# EAGLE design LB_BIT_w29_PERF-v03(1_3) (EAGLE 6.6.0)
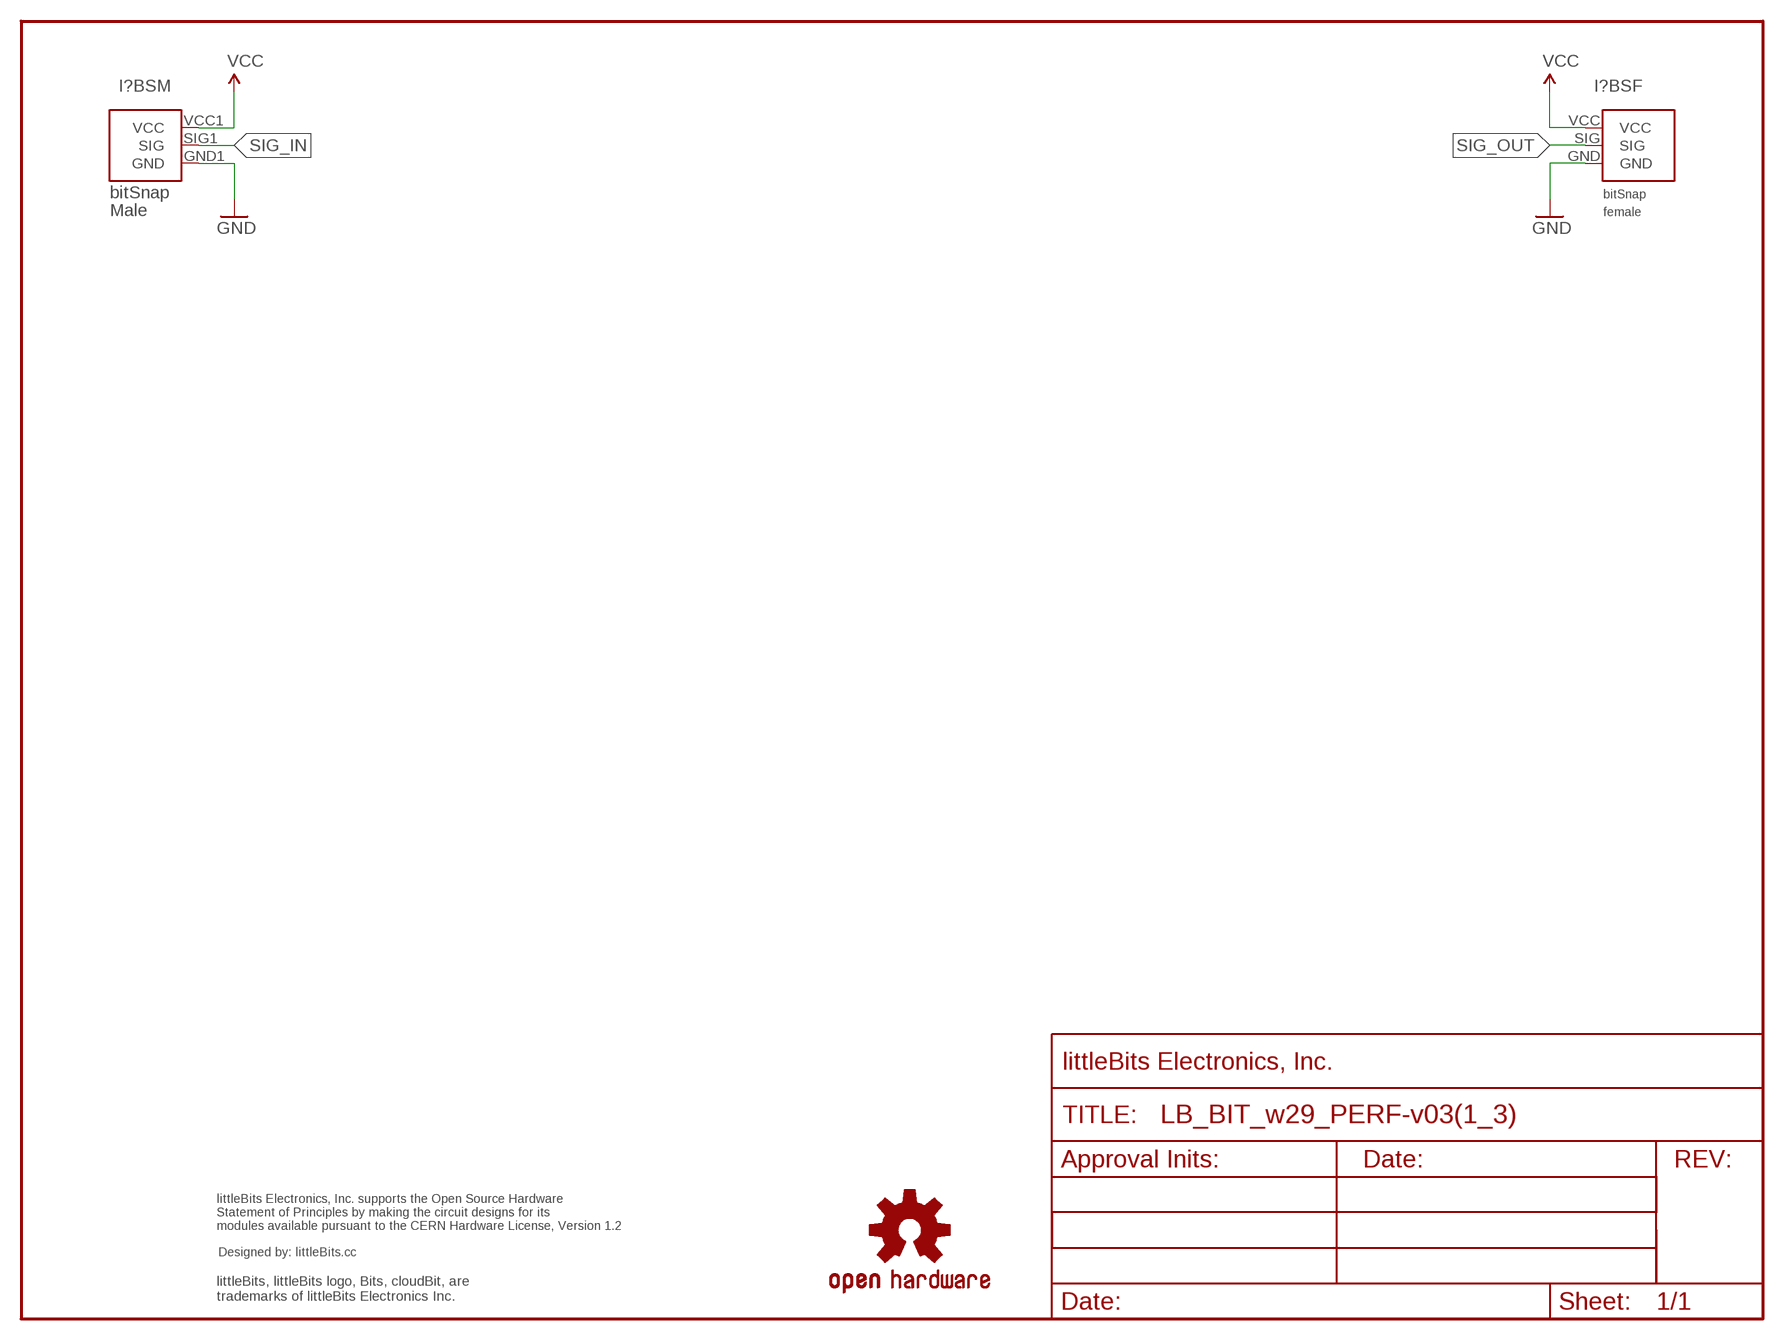
[diagram p0: schematic, sheet 1]

## Parts
I?BSF  BITSNAP_V03_FEMALE  [BITSNAP_V03_FEMALE]
I?BSM  BITSNAP_V03_MALE  [BITSNAP_V03_MALE]
U$1  OSHWCREDIT  [OSHWCREDIT]
U$2  OSHW-LOGOL  [OSHW-LOGO-L]
U$18  FRAME-LETTER-OHWOHW  [FABDWG01-OHW]

## Nets
GND: I?BSF.GND I?BSM.GND1(GND)
SIG_IN: I?BSM.SIG1(SIG)
SIG_OUT: I?BSF.SIG
VCC: I?BSF.VCC I?BSM.VCC1(VCC)

## Library data of the parts
I?BSF = bitSnap:BITSNAP_V03_FEMALE
I?BSM = bitSnap:BITSNAP_V03_MALE
U$1 = LITTLEBITS:OSHWCREDIT
U$2 = LITTLEBITS131206:OSHW-LOGO: Open Source Hardware Logo This logo indicates the piece of hardware it is found on incorporates a OSHW license and/or adheres to the definition of open source hardware found here: http://freedomdefined.org/OSHW
U$18 = LITTLEBITS:FRAME-LETTER-OHW

## Board
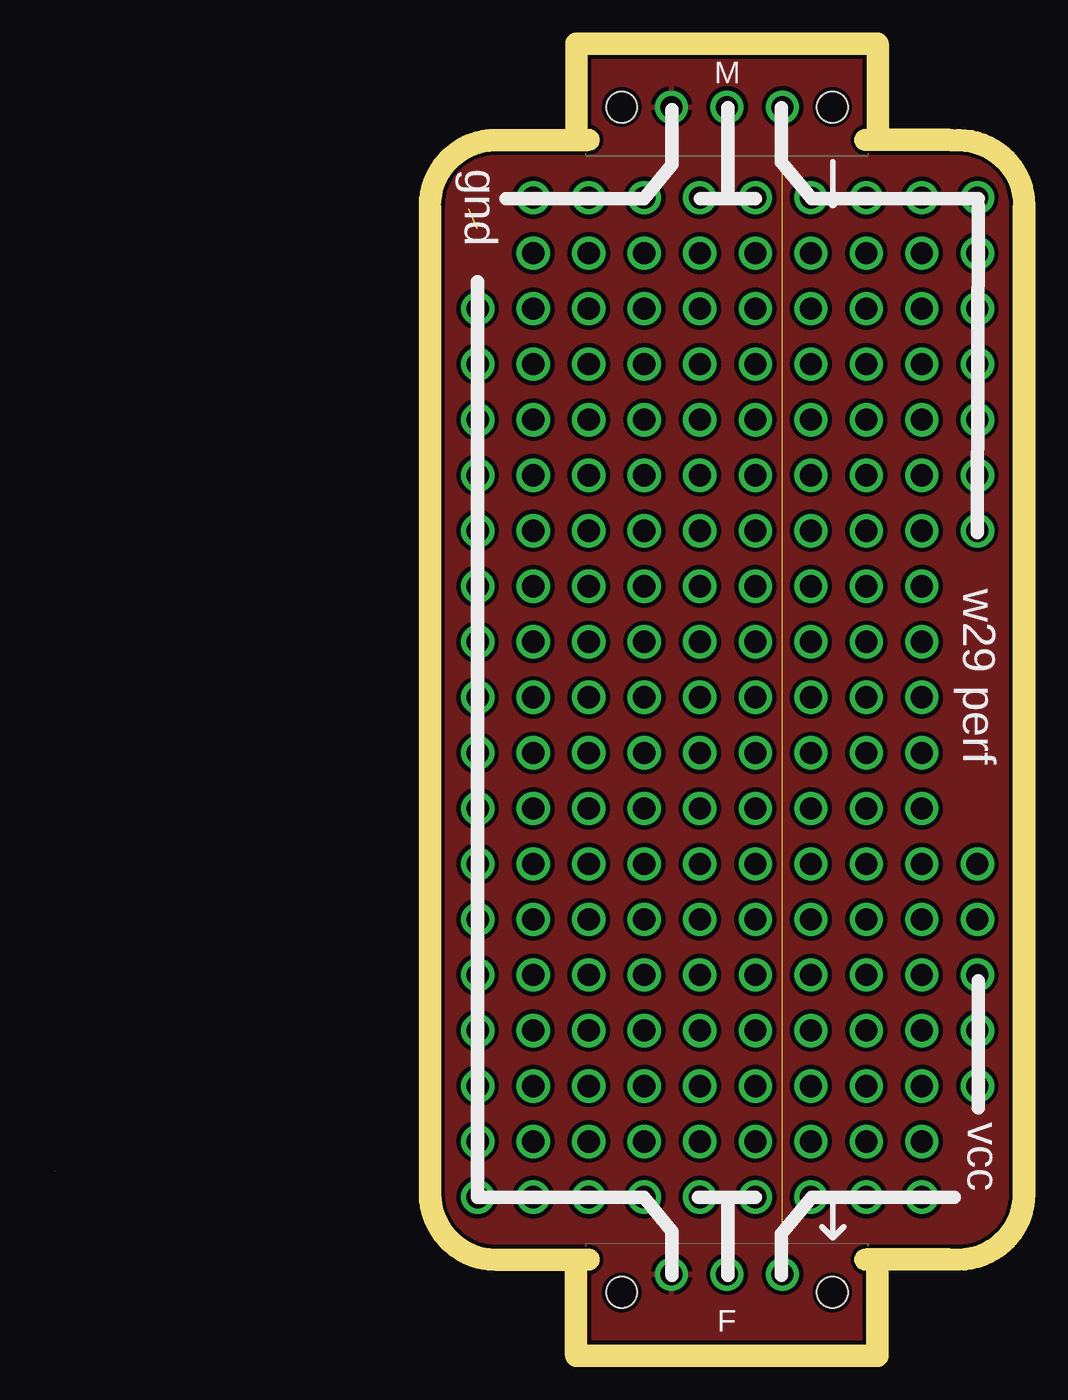
[diagram p1: board, top side]
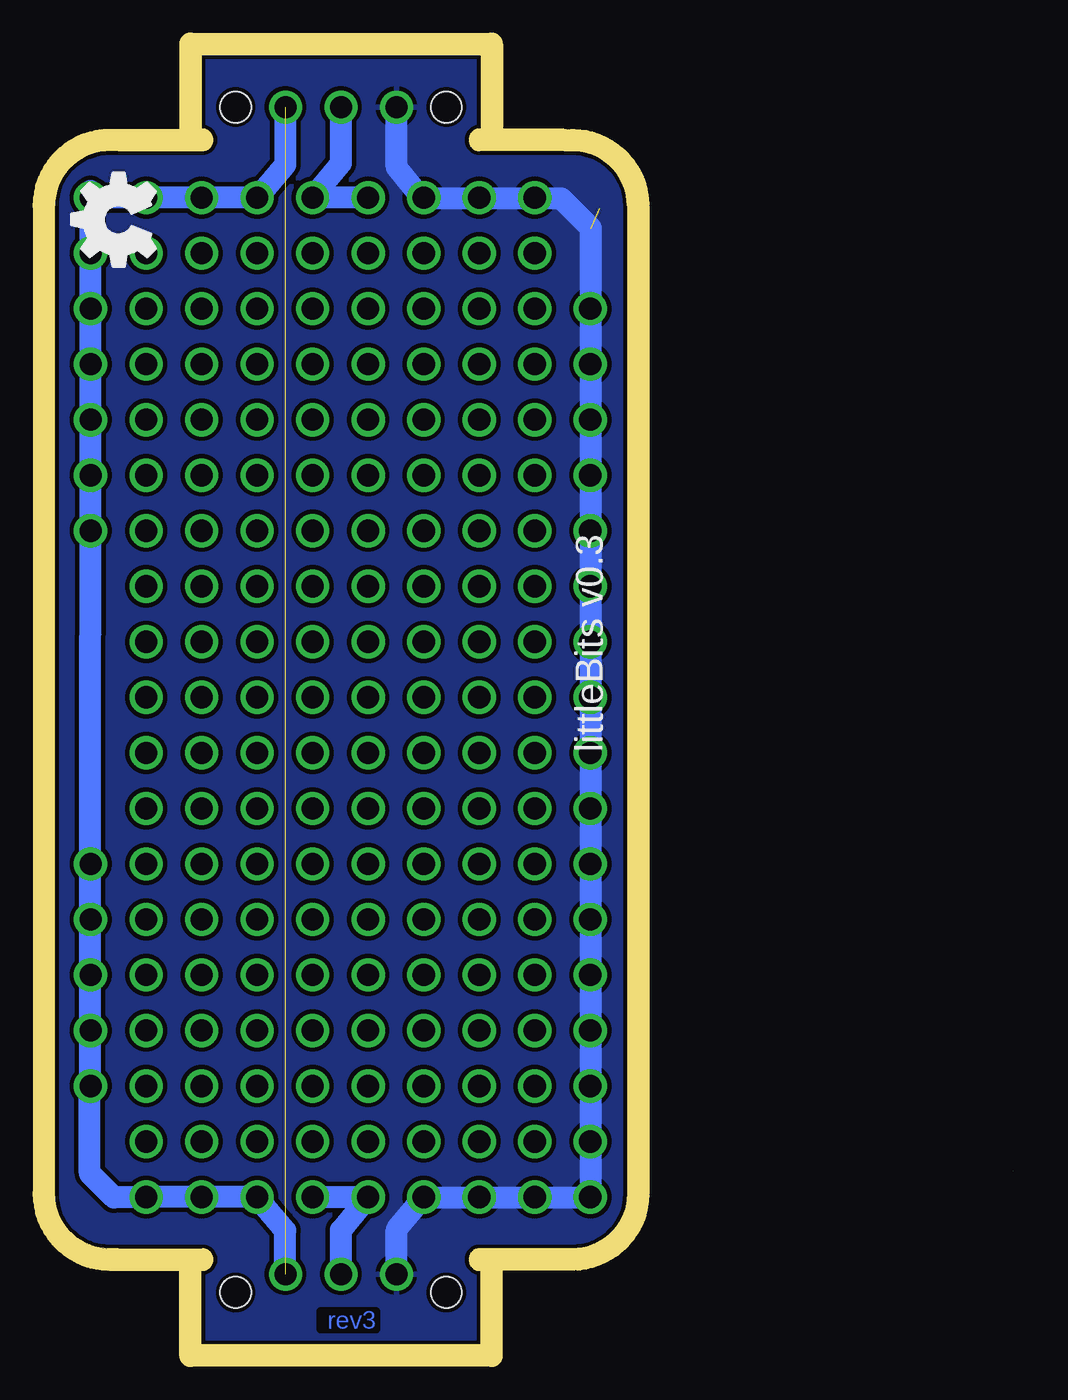
[diagram p2: board, bottom side, seen from below]

Size 43.86 x 59.02 mm. Coordinates in mm from the lower left corner, seen from the top.
Outline: 20.56,4.4 20.16,4.4 arc-90 17.66,6.9 17.66,52.12 arc-90 20.16,54.62 20.56,54.62
Outline: 40.96,54.62 41.36,54.62 arc-90 43.86,52.12 43.86,6.9 arc-90 41.36,4.4 40.96,4.4
Outline: 0,7.95 arc0 0,7.95
Copper layers (1*16): Top 0.035mm / dielectric 1.5mm / Bottom 0.035mm
Design rules "default": minimum track width 0.2mm, minimum drill 0.4mm, track to track 0.2mm, track to pad 0.2mm, pad to pad 0.2mm, via to via 0.2mm, smd to smd 0mil, copper to edge 0.2mm, drill to drill 0.2mm, minimum pad ring 0.2mm, minimum via ring 0.15mm, stop-mask expansion 0.1mm, vias tented up to drill 0mil, thermal gap 0.2mm
Milling: 10 lines

### Footprints (pad centres in the part's own frame; a part is rotated, then mirrored left to right if it is on the bottom)
BITSNAP_V03_FEMALE = drill 1: GND 4.065,3.44; SIG 6.605,3.44; VCC 9.145,3.44 | hole 1.4: 1.785,2.61; 11.425,2.61
BITSNAP_V03_MALE = drill 1: GND1 9.145,2.61; SIG1 6.605,2.61; VCC1 4.065,2.61 | hole 1.4: 1.785,2.61; 11.425,2.61

### Placement (x,y rotation side)
DRILEGEND  [DRILEGEND]  9.8,-26.69 0 top  (outside the outline)
I?BSF  24.16,-0.21 0 top
I?BSM  37.37,59.23 180 top
U$1  -73.12,-62.87 0 top  (outside the outline)
U$2  -12.81,-67.32 0 top  (outside the outline)
U$11  [OSHW_FILLX150_NOTEXT]  39.26,48.52 0 top
U$18  17.55,-0.21 0 top

### Tracks (layer width: path | path; a pad name or v marks a point on that pad's centre or on a via)
GND  (2 unrouted)
  Bottom 0.61: I?BSM.GND1
  Bottom 1.016: I?BSF.GND 28.21,5.28 26.99,6.75 19.32,6.75 19.33,8.24 19.33,51.07 | 19.32,51.09 20.68,52.44 27.04,52.44 28.21,53.87 I?BSM.GND1
  pour Bottom: 17.66,-0.25 43.86,-0.25 43.86,59.25 17.66,59.25
  pour Top: 43.86,-0.25 43.86,59.25 17.66,59.25 17.66,0.39 17.66,-0.25
N$1
  Bottom 1.016: 30.77,3.25 30.77,5.25 29.51,6.75 32.08,6.75
N$2
  Bottom 1.016: 30.77,56.6 30.77,54.04 32.07,52.49 29.51,52.49
N$3
  Bottom 1.016: 34.62,6.78 39.7,6.78
N$4  (via drill 1.02)
  other vias: 21.89,52.48
N$5
  Bottom 0.61: 42.22,52.78 42.21,52.49 42.21,52.48 | 33.3,56.62 33.28,56.63
  Bottom 1.016: 42.23,12.11 42.22,52.78 | 42.21,52.48 41.09,52.49 34.55,52.49 33.3,53.99 33.3,56.62
N$6
  Bottom 1.016: 33.31,3.25 33.31,5.24 34.62,6.78
N$7
  Bottom 1.016: 39.75,6.74 41.15,6.74 42.25,7.84 42.25,11.84
N$8  (via drill 1.02)
  other vias: 19.36,42.32
N$9  (via drill 1.02)
  other vias: 21.89,42.32
N$10  (via drill 1.02)
  other vias: 42.22,52.48
N$11  (via drill 1.02)
  other vias: 39.67,52.48
N$12  (via drill 1.02)
  other vias: 37.14,52.48
N$13  (via drill 1.02)
  other vias: 34.59,52.48
N$14  (via drill 1.02)
  other vias: 32.05,52.48
N$15  (via drill 1.02)
  other vias: 29.52,52.48
N$16  (via drill 1.02)
  other vias: 26.98,52.48
N$17  (via drill 1.02)
  other vias: 24.44,52.48
N$18  (via drill 1.02)
  other vias: 42.22,42.32
N$19  (via drill 1.02)
  other vias: 21.89,49.94
N$20  (via drill 1.02)
  other vias: 39.67,42.32
N$21  (via drill 1.02)
  other vias: 42.22,49.94
N$22  (via drill 1.02)
  other vias: 39.67,49.94
N$23  (via drill 1.02)
  other vias: 37.14,49.94
N$24  (via drill 1.02)
  other vias: 34.59,49.94
N$25  (via drill 1.02)
  other vias: 32.05,49.94
N$26  (via drill 1.02)
  other vias: 29.52,49.94
N$27  (via drill 1.02)
  other vias: 26.98,49.94
N$28  (via drill 1.02)
  other vias: 24.44,49.94
N$29  (via drill 1.02)
  other vias: 19.36,47.4
N$30  (via drill 1.02)
  other vias: 21.89,47.4
N$31  (via drill 1.02)
  other vias: 37.14,42.32
N$32  (via drill 1.02)
  other vias: 42.22,47.4
N$33  (via drill 1.02)
  other vias: 39.67,47.4
N$34  (via drill 1.02)
  other vias: 37.14,47.4
N$35  (via drill 1.02)
  other vias: 34.59,47.4
N$36  (via drill 1.02)
  other vias: 32.05,47.4
N$37  (via drill 1.02)
  other vias: 29.52,47.4
N$38  (via drill 1.02)
  other vias: 26.98,47.4
N$39  (via drill 1.02)
  other vias: 24.44,47.4
N$40  (via drill 1.02)
  other vias: 19.36,44.86
N$41  (via drill 1.02)
  other vias: 21.89,44.86
N$42  (via drill 1.02)
  other vias: 34.59,42.32
N$43  (via drill 1.02)
  other vias: 42.22,44.86
N$44  (via drill 1.02)
  other vias: 39.67,44.86
N$45  (via drill 1.02)
  other vias: 37.14,44.86
N$46  (via drill 1.02)
  other vias: 34.59,44.86
N$47  (via drill 1.02)
  other vias: 32.05,44.86
N$48  (via drill 1.02)
  other vias: 29.52,44.86
N$49  (via drill 1.02)
  other vias: 26.98,44.86
N$50  (via drill 1.02)
  other vias: 24.44,44.86
N$51  (via drill 1.02)
  other vias: 19.36,29.62
N$52  (via drill 1.02)
  other vias: 21.89,29.62
N$53  (via drill 1.02)
  other vias: 32.05,42.32
N$55  (via drill 1.02)
  other vias: 39.67,29.62
N$56  (via drill 1.02)
  other vias: 37.14,29.62
N$57  (via drill 1.02)
  other vias: 34.59,29.62
N$58  (via drill 1.02)
  other vias: 32.05,29.62
N$59  (via drill 1.02)
  other vias: 29.52,29.62
N$60  (via drill 1.02)
  other vias: 26.98,29.62
N$61  (via drill 1.02)
  other vias: 24.44,29.62
N$62  (via drill 1.02)
  other vias: 19.36,27.08
N$63  (via drill 1.02)
  other vias: 21.89,27.08
N$64  (via drill 1.02)
  other vias: 29.52,42.32
N$65  (via drill 1.02)
  other vias: 26.98,42.32
N$66  (via drill 1.02)
  other vias: 39.67,27.08
N$67  (via drill 1.02)
  other vias: 37.14,27.08
N$68  (via drill 1.02)
  other vias: 34.59,27.08
N$69  (via drill 1.02)
  other vias: 32.05,27.08
N$70  (via drill 1.02)
  other vias: 29.52,27.08
N$71  (via drill 1.02)
  other vias: 26.98,27.08
N$72  (via drill 1.02)
  other vias: 24.44,27.08
N$73  (via drill 1.02)
  other vias: 19.36,24.54
N$74  (via drill 1.02)
  other vias: 21.89,24.54
N$75  (via drill 1.02)
  other vias: 24.44,42.32
N$76  (via drill 1.02)
  other vias: 19.36,39.78
N$77  (via drill 1.02)
  other vias: 39.67,24.54
N$78  (via drill 1.02)
  other vias: 37.14,24.54
N$79  (via drill 1.02)
  other vias: 34.59,24.54
N$80  (via drill 1.02)
  other vias: 32.05,24.54
N$81  (via drill 1.02)
  other vias: 29.52,24.54
N$82  (via drill 1.02)
  other vias: 26.98,24.54
N$83  (via drill 1.02)
  other vias: 24.44,24.54
N$84  (via drill 1.02)
  other vias: 19.36,22
N$85  (via drill 1.02)
  other vias: 21.89,22
N$86  (via drill 1.02)
  other vias: 21.89,39.78
N$87  (via drill 1.02)
  other vias: 42.22,39.78
N$88  (via drill 1.02)
  other vias: 39.67,22
N$89  (via drill 1.02)
  other vias: 37.14,22
N$90  (via drill 1.02)
  other vias: 34.59,22
N$91  (via drill 1.02)
  other vias: 32.05,22
N$92  (via drill 1.02)
  other vias: 29.52,22
N$93  (via drill 1.02)
  other vias: 26.98,22
N$94  (via drill 1.02)
  other vias: 24.44,22
N$95  (via drill 1.02)
  other vias: 19.36,19.46
N$96  (via drill 1.02)
  other vias: 21.89,19.46
N$97  (via drill 1.02)
  other vias: 39.67,39.78
N$98  (via drill 1.02)
  other vias: 37.14,39.78
N$99  (via drill 1.02)
  other vias: 39.67,19.46
N$100  (via drill 1.02)
  other vias: 37.14,19.46
N$101  (via drill 1.02)
  other vias: 34.59,19.46
N$102  (via drill 1.02)
  other vias: 32.05,19.46
N$103  (via drill 1.02)
  other vias: 29.52,19.46
N$104  (via drill 1.02)
  other vias: 26.98,19.46
N$105  (via drill 1.02)
  other vias: 24.44,19.46
N$106  (via drill 1.02)
  other vias: 19.36,16.92
N$107  (via drill 1.02)
  other vias: 21.89,16.92
N$108  (via drill 1.02)
  other vias: 34.59,39.78
N$109  (via drill 1.02)
  other vias: 42.22,16.92
N$110  (via drill 1.02)
  other vias: 39.67,16.92
N$111  (via drill 1.02)
  other vias: 37.14,16.92
N$112  (via drill 1.02)
  other vias: 34.59,16.92
N$113  (via drill 1.02)
  other vias: 32.05,16.92
N$114  (via drill 1.02)
  other vias: 29.52,16.92
N$115  (via drill 1.02)
  other vias: 26.98,16.92
N$116  (via drill 1.02)
  other vias: 24.44,16.92
N$117  (via drill 1.02)
  other vias: 19.36,14.38
N$118  (via drill 1.02)
  other vias: 21.89,14.38
N$119  (via drill 1.02)
  other vias: 32.05,39.78
N$120  (via drill 1.02)
  other vias: 42.22,14.38
N$121  (via drill 1.02)
  other vias: 39.67,14.38
N$122  (via drill 1.02)
  other vias: 37.14,14.38
N$123  (via drill 1.02)
  other vias: 34.59,14.38
N$124  (via drill 1.02)
  other vias: 32.05,14.38
N$125  (via drill 1.02)
  other vias: 29.52,14.38
N$126  (via drill 1.02)
  other vias: 26.98,14.38
N$127  (via drill 1.02)
  other vias: 24.44,14.38
N$128  (via drill 1.02)
  other vias: 19.36,11.84
N$129  (via drill 1.02)
  other vias: 21.89,11.84
N$130  (via drill 1.02)
  other vias: 29.52,39.78
N$131  (via drill 1.02)
  other vias: 42.22,11.84
N$132  (via drill 1.02)
  other vias: 39.67,11.84
N$133  (via drill 1.02)
  other vias: 37.14,11.84
N$134  (via drill 1.02)
  other vias: 34.59,11.84
N$135  (via drill 1.02)
  other vias: 32.05,11.84
N$136  (via drill 1.02)
  other vias: 29.52,11.84
N$137  (via drill 1.02)
  other vias: 26.98,11.84
N$138  (via drill 1.02)
  other vias: 24.44,11.84
N$139  (via drill 1.02)
  other vias: 19.36,9.3
N$140  (via drill 1.02)
  other vias: 21.89,9.3
N$141  (via drill 1.02)
  other vias: 26.98,39.78
N$142  (via drill 1.02)
  other vias: 24.44,39.78
N$143  (via drill 1.02)
  other vias: 39.67,9.3
N$144  (via drill 1.02)
  other vias: 37.14,9.3
N$145  (via drill 1.02)
  other vias: 34.59,9.3
N$146  (via drill 1.02)
  other vias: 32.05,9.3
N$147  (via drill 1.02)
  other vias: 29.52,9.3
N$148  (via drill 1.02)
  other vias: 26.98,9.3
N$149  (via drill 1.02)
  other vias: 24.44,9.3
N$150  (via drill 1.02)
  other vias: 19.36,6.76
N$151  (via drill 1.02)
  other vias: 21.89,6.76
N$152  (via drill 1.02)
  other vias: 19.36,37.24
N$153  (via drill 1.02)
  other vias: 21.89,37.24
N$154  (via drill 1.02)
  other vias: 39.67,6.76
N$155  (via drill 1.02)
  other vias: 37.14,6.76
N$156  (via drill 1.02)
  other vias: 34.59,6.76
N$157  (via drill 1.02)
  other vias: 32.05,6.76
N$158  (via drill 1.02)
  other vias: 29.52,6.76
N$159  (via drill 1.02)
  other vias: 26.98,6.76
N$160  (via drill 1.02)
  other vias: 24.44,6.76
N$161  (via drill 1.02)
  other vias: 42.22,37.24
N$162  (via drill 1.02)
  other vias: 39.67,37.24
N$163  (via drill 1.02)
  other vias: 37.14,37.24
N$164  (via drill 1.02)
  other vias: 34.59,37.24
N$165  (via drill 1.02)
  other vias: 32.05,37.24
N$166  (via drill 1.02)
  other vias: 29.52,37.24
N$167  (via drill 1.02)
  other vias: 26.98,37.24
N$168  (via drill 1.02)
  other vias: 24.44,37.24
N$169  (via drill 1.02)
  other vias: 19.36,34.7
N$170  (via drill 1.02)
  other vias: 21.89,34.7
N$172  (via drill 1.02)
  other vias: 39.67,34.7
N$173  (via drill 1.02)
  other vias: 37.14,34.7
N$174  (via drill 1.02)
  other vias: 34.59,34.7
N$175  (via drill 1.02)
  other vias: 32.05,34.7
N$176  (via drill 1.02)
  other vias: 29.52,34.7
N$177  (via drill 1.02)
  other vias: 26.98,34.7
N$178  (via drill 1.02)
  other vias: 24.44,34.7
N$179  (via drill 1.02)
  other vias: 19.36,32.16
N$180  (via drill 1.02)
  other vias: 21.89,32.16
N$182  (via drill 1.02)
  other vias: 39.67,32.16
N$183  (via drill 1.02)
  other vias: 37.14,32.16
N$184  (via drill 1.02)
  other vias: 34.59,32.16
N$185  (via drill 1.02)
  other vias: 32.05,32.16
N$186  (via drill 1.02)
  other vias: 29.52,32.16
N$187  (via drill 1.02)
  other vias: 26.98,32.16
N$188  (via drill 1.02)
  other vias: 24.44,32.16
N$189  (via drill 1.02)
  other vias: 42.22,16.92
N$190  (via drill 1.02)
  other vias: 42.22,19.46
N$191  (via drill 1.02)
  other vias: 42.22,22
VCC  (1 unrouted)

### Text on the board
Bottom: rev3
tPlace: gnd | w29 perf | vcc
bPlace: littleBits v0.3
dxf: The silk from the center pin is purple. | The silkscreen on this side of the board is blue. | The text "w29 perf" is purple. | The silkscreen on this side of the board is red. | The silk from the center pin is purple.
DrillLegend: LAYER-STACK
DrillLegend_01-16: 01-16
DrillLegend_01-20: 01-20